# Altium schematic sheet Main.SchDoc
size A4
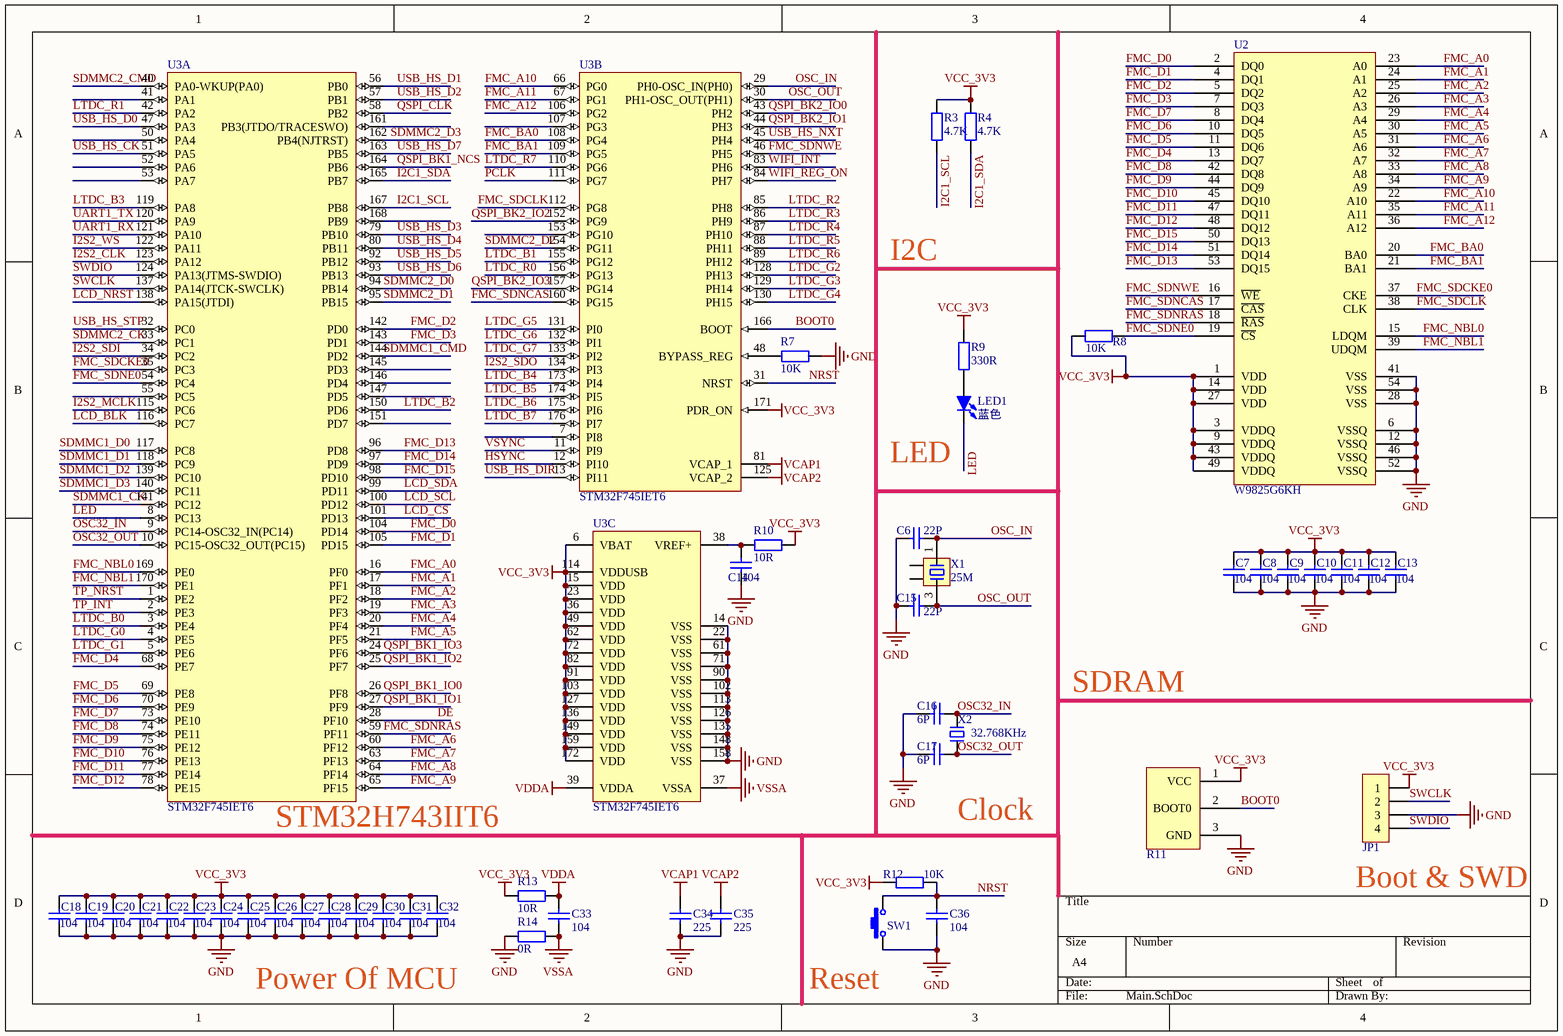
[diagram p0: Main.SchDoc]

## Parts
C6  22P  [C0402_M]
C7  104  [C0402_M]
C8  104  [C0402_M]
C9  104  [C0402_M]
C10  104  [C0402_M]
C11  104  [C0402_M]
C12  104  [C0402_M]
C13  104  [C0402_M]
C14  104  [C0402_M]
C15  22P  [C0402_M]
C16  6P  [C0402_M]
C17  6P  [C0402_M]
C18  104  [C0402_M]
C19  104  [C0402_M]
C20  104  [C0402_M]
C21  104  [C0402_M]
C22  104  [C0402_M]
C23  104  [C0402_M]
C24  104  [C0402_M]
C25  104  [C0402_M]
C26  104  [C0402_M]
C27  104  [C0402_M]
C28  104  [C0402_M]
C29  104  [C0402_M]
C30  104  [C0402_M]
C31  104  [C0402_M]
C32  104  [C0402_M]
C33  104  [C0402_M]
C34  225  [C0402_M]
C35  225  [C0402_M]
C36  104  [C0402_M]
JP1  HDR-1X4  [HDR2.54-WS-4P]  (value not drawn)
LED1  蓝色  [LED0603_B]
R3  4.7K  [R0402_M]
R4  4.7K  [R0402_M]
R7  10K  [R0402_M]
R8  10K  [R0402_M]
R9  330R  [R0402_M]
R10  10R  [R0402_M]
R11  BOOT0_0603  [BOOT0_0603]  (value not drawn)
R12  10K  [R0402_M]
R13  10R  [R0402_M]
R14  0R  [R0402_M]
SW1  3x6x5  [SW SMD-3*6*2.5]  (value not drawn)
U2  W9825G6KH  [TSOP-54]
U3  STM32F745IET6  [STM-LQFP176_M]  (parts A,B,C of 3)
X1  25M  [XTAL-3225-4P]
X2  32.768KHz  [OSC-3215-2P]

## Nets
GND: C6.1 C7.1 C8.1 C9.1 C10.1 C11.1 C12.1 C13.1 C14.1 C15.1 C16.2 C17.2 C18.1 C19.1 C20.1 C21.1 C22.1 C23.1 C24.1 C25.1 C26.1 C27.1 C28.1 C29.1 C30.1 C31.1 C32.1 C34.1 C35.1 C36.1 JP1.3 R7.1 R11.3(GND) R14.1 SW1.1 U2.6(VSSQ) U2.12(VSSQ) U2.28(VSS) U2.41(VSS) U2.46(VSSQ) U2.52(VSSQ) U2.54(VSS) U3.14(VSS) U3.22(VSS) U3.61(VSS) U3.71(VSS) U3.90(VSS) U3.102(VSS) U3.113(VSS) U3.126(VSS) U3.135(VSS) U3.148(VSS) U3.158(VSS)
VCAP1: C34.2 U3.81(VCAP_1)
VCAP2: C35.2 U3.125(VCAP_2)
VCC_3V3: C7.2 C8.2 C9.2 C10.2 C11.2 C12.2 C13.2 C18.2 C19.2 C20.2 C21.2 C22.2 C23.2 C24.2 C25.2 C26.2 C27.2 C28.2 C29.2 C30.2 C31.2 C32.2 JP1.1 R3.1 R4.1 R8.2 R9.1 R10.1 R11.1(VCC) R12.1 R13.1 U2.1(VDD) U2.3(VDDQ) U2.9(VDDQ) U2.14(VDD) U2.27(VDD) U2.43(VDDQ) U2.49(VDDQ) U3.6(VBAT) U3.15(VDD) U3.23(VDD) U3.36(VDD) U3.49(VDD) U3.62(VDD) U3.72(VDD) U3.82(VDD) U3.91(VDD) U3.103(VDD) U3.114(VDDUSB) U3.127(VDD) U3.136(VDD) U3.149(VDD) U3.159(VDD) U3.171(PDR_ON) U3.172(VDD)
VDDA: C33.2 R13.2 U3.39(VDDA)
VSSA: C33.1 R14.2 U3.37(VSSA)
BOOT0: R11.2(BOOT0) U3.166(BOOT)
DE: U3.28(PF10)
FMC_A0: U2.23(A0) U3.16(PF0)
FMC_A1: U2.24(A1) U3.17(PF1)
FMC_A2: U2.25(A2) U3.18(PF2)
FMC_A3: U2.26(A3) U3.19(PF3)
FMC_A4: U2.29(A4) U3.20(PF4)
FMC_A5: U2.30(A5) U3.21(PF5)
FMC_A6: U2.31(A6) U3.60(PF12)
FMC_A7: U2.32(A7) U3.63(PF13)
FMC_A8: U2.33(A8) U3.64(PF14)
FMC_A9: U2.34(A9) U3.65(PF15)
FMC_A10: U2.22(A10) U3.66(PG0)
FMC_A11: U2.35(A11) U3.67(PG1)
FMC_A12: U2.36(A12) U3.106(PG2)
FMC_BA0: U2.20(BA0) U3.108(PG4)
FMC_BA1: U2.21(BA1) U3.109(PG5)
FMC_D0: U2.2(DQ0) U3.104(PD14)
FMC_D1: U2.4(DQ1) U3.105(PD15)
FMC_D2: U2.5(DQ2) U3.142(PD0)
FMC_D3: U2.7(DQ3) U3.143(PD1)
FMC_D4: U2.13(DQ7) U3.68(PE7)
FMC_D5: U2.11(DQ6) U3.69(PE8)
FMC_D6: U2.10(DQ5) U3.70(PE9)
FMC_D7: U2.8(DQ4) U3.73(PE10)
FMC_D8: U2.42(DQ8) U3.74(PE11)
FMC_D9: U2.44(DQ9) U3.75(PE12)
FMC_D10: U2.45(DQ10) U3.76(PE13)
FMC_D11: U2.47(DQ11) U3.77(PE14)
FMC_D12: U2.48(DQ12) U3.78(PE15)
FMC_D13: U2.53(DQ15) U3.96(PD8)
FMC_D14: U2.51(DQ14) U3.97(PD9)
FMC_D15: U2.50(DQ13) U3.98(PD10)
FMC_NBL0: U2.15(LDQM) U3.169(PE0)
FMC_NBL1: U2.39(UDQM) U3.170(PE1)
FMC_SDCKE0: U2.37(CKE) U3.35(PC3)
FMC_SDCLK: U2.38(CLK) U3.112(PG8)
FMC_SDNCAS: U2.17(~{CAS}) U3.160(PG15)
FMC_SDNE0: R8.1 U2.19(~{CS}) U3.54(PC4)
FMC_SDNRAS: U2.18(~{RAS}) U3.59(PF11)
FMC_SDNWE: U2.16(~{WE}) U3.46(PH5)
HSYNC: U3.12(PI10)
I2C1_SCL: R3.2 U3.167(PB8)
I2C1_SDA: R4.2 U3.165(PB7)
I2S2_CLK: U3.123(PA12)
I2S2_MCLK: U3.115(PC6)
I2S2_SDI: U3.34(PC2)
I2S2_SDO: U3.134(PI3)
I2S2_WS: U3.122(PA11)
LCD_BLK: U3.116(PC7)
LCD_CS: U3.101(PD13)
LCD_NRST: U3.138(PA15(JTDI))
LCD_SCL: U3.100(PD12)
LCD_SDA: U3.99(PD11)
LED: LED1.2(K) U3.8(PC13)
LTDC_B0: U3.3(PE4)
LTDC_B1: U3.155(PG12)
LTDC_B2: U3.150(PD6)
LTDC_B3: U3.119(PA8)
LTDC_B4: U3.173(PI4)
LTDC_B5: U3.174(PI5)
LTDC_B6: U3.175(PI6)
LTDC_B7: U3.176(PI7)
LTDC_G0: U3.4(PE5)
LTDC_G1: U3.5(PE6)
LTDC_G2: U3.128(PH13)
LTDC_G3: U3.129(PH14)
LTDC_G4: U3.130(PH15)
LTDC_G5: U3.131(PI0)
LTDC_G6: U3.132(PI1)
LTDC_G7: U3.133(PI2)
LTDC_R0: U3.156(PG13)
LTDC_R1: U3.42(PA2)
LTDC_R2: U3.85(PH8)
LTDC_R3: U3.86(PH9)
LTDC_R4: U3.87(PH10)
LTDC_R5: U3.88(PH11)
LTDC_R6: U3.89(PH12)
LTDC_R7: U3.110(PG6)
NRST: C36.2 R12.2 SW1.2 U3.31(NRST)
OSC32_IN: C16.1 U3.9(PC14-OSC32_IN(PC14)) X2.1
OSC32_OUT: C17.1 U3.10(PC15-OSC32_OUT(PC15)) X2.2
OSC_IN: C6.2 U3.29(PH0-OSC_IN(PH0)) X1.1
OSC_OUT: C15.2 U3.30(PH1-OSC_OUT(PH1)) X1.3
PCLK: U3.111(PG7)
QSPI_BK1_IO0: U3.26(PF8)
QSPI_BK1_IO1: U3.27(PF9)
QSPI_BK1_IO2: U3.25(PF7)
QSPI_BK1_IO3: U3.24(PF6)
QSPI_BK1_NCS: U3.164(PB6)
QSPI_BK2_IO0: U3.43(PH2)
QSPI_BK2_IO1: U3.44(PH3)
QSPI_BK2_IO2: U3.152(PG9)
QSPI_BK2_IO3: U3.157(PG14)
QSPI_CLK: U3.58(PB2)
SDMMC1_CK: U3.141(PC12)
SDMMC1_CMD: U3.144(PD2)
SDMMC1_D0: U3.117(PC8)
SDMMC1_D1: U3.118(PC9)
SDMMC1_D2: U3.139(PC10)
SDMMC1_D3: U3.140(PC11)
SDMMC2_CK: U3.33(PC1)
SDMMC2_CMD: U3.40(PA0-WKUP(PA0))
SDMMC2_D0: U3.94(PB14)
SDMMC2_D1: U3.95(PB15)
SDMMC2_D2: U3.154(PG11)
SDMMC2_D3: U3.162(PB4(NJTRST))
SWCLK: JP1.2 U3.137(PA14(JTCK-SWCLK))
SWDIO: JP1.4 U3.124(PA13(JTMS-SWDIO))
TP_INT: U3.2(PE3)
TP_NRST: U3.1(PE2)
UART1_RX: U3.121(PA10)
UART1_TX: U3.120(PA9)
USB_HS_CK: U3.51(PA5)
USB_HS_D0: U3.47(PA3)
USB_HS_D1: U3.56(PB0)
USB_HS_D2: U3.57(PB1)
USB_HS_D3: U3.79(PB10)
USB_HS_D4: U3.80(PB11)
USB_HS_D5: U3.92(PB12)
USB_HS_D6: U3.93(PB13)
USB_HS_D7: U3.163(PB5)
USB_HS_DIR: U3.13(PI11)
USB_HS_NXT: U3.45(PH4)
USB_HS_STP: U3.32(PC0)
VSYNC: U3.11(PI9)
WIFI_INT: U3.83(PH6)
WIFI_REG_ON: U3.84(PH7)
NetC14_2: C14.2 R10.2 U3.38(VREF+)
NetLED1_1: LED1.1(A) R9.2
NetR7_2: R7.2 U3.48(BYPASS_REG)

Not connected (* = marked no-connect by the designer): U3 7(PI8) 41(PA1) 50(PA4) 52(PA6) 53(PA7) 55(PC5) 107(PG3) 145(PD3) 146(PD4) 147(PD5) 151(PD7) 153(PG10) 161(PB3(JTDO/TRACESWO)) 168(PB9); X1 2 4

## Notes on the sheet
- I2C
- (near LED1) LED
- SDRAM
- (near U3) STM32H743IIT6
- Clock
- (near JP1) Boot & SWD
- Power Of MCU
- (near SW1) Reset

## Library data of the parts
C6-C36 = C: 贴片电容/MLCC电容; BOM名称: 无极性贴片电容; 联系卖家，免费查找封装: 唯一出售店铺网址https://shop463601444.taobao.com
JP1 = Header 4: 4P接插件; 以赠品形式获赠本封装库的买家，还可联系卖家免费指导AD软件使用: 联系卖家 免费技术支持; 联系卖家，免费查找封装: 唯一出售店铺网址https://shop463601444.taobao.com
LED1 = LED-SMD: 贴片LED; 封装库来自淘宝卖家ID：黄晶宝石: 其他店铺购入均为盗版封装库，请立即申请退款，本店现金奖励20~200元; BOM名称: 贴片LED
R3 R4 R7-R10 R12-R14 = R: 贴片电阻; 联系卖家，免费查找封装: 唯一出售店铺网址https://shop463601444.taobao.com; BOM名称: 贴片电阻
SW1 = SW 3x6: 3x6轻触开关; 联系卖家，免费查找封装: 唯一出售店铺网址https://shop463601444.taobao.com; 封装库来自淘宝卖家ID：黄晶宝石: 其他店铺购入的，请立即申请退款，本店现金奖励20~500元; BOM名称: 3x6轻触开关
U2 = W9825G6KH: SDRAM 易失性动态存储器
U3 = STM32F745IET6: ARM-Based Cortex-M7 32 Bit MCU+FPU, 462 DMIPS, 512 kB Flash, 320 kB RAM, 140 I/Os, -40 to 85 degC, 176-Pin LQFP, Halogen-Free, Tray; Clock Frequency Max: 216 MHz; L1 Cache Instruction Memory: 4 KByte; Data RAM Size: 320 KByte; Program Memory Size: 512 KByte; Supply Voltage Max: 3.6 V; Supply Voltage Min: 1.7 V; Number of I/Os: 140; DatasheetVersion: Rev. 1; ComponentLink3Description: Package Specification; Temperature Min: -40 degC; Packing: Tray; ComponentLink2URL: http://www.st.com/st-web-ui/static/active/en/resource/technical/document/datasheet/DM00166116.pdf; ComponentLink1Description: Manufacturer URL; Temperature Max: 85 degC; ComponentLink1URL: http://www.st.com/web/en/home.html; Mounting Technology: Surface Mount; ComponentLink2Description: Datasheet; ComponentLink3URL: http://www.st.com/st-web-ui/static/active/en/resource/technical/document/datasheet/DM00035129.pdf; PartNumber: STM32F745IE; PackageDescription: 176-Pin Low Profile Quad Flat Package, 24 x 24 mm Body, 0.5 mm Pitch; L1 Cache Data Memory: 4 KByte
X1 = XTAL-4P: 4脚无源晶振(谐振器）; 联系卖家，免费查找封装: 唯一出售店铺网址https://shop463601444.taobao.com; BOM名称: 4脚无源晶振(谐振器）
X2 = XTAL-2P: 2脚无源脚晶振; 版权归属: 源创客; BOM名称: 2脚无源脚晶振; 学习资源: www.ooocke.com